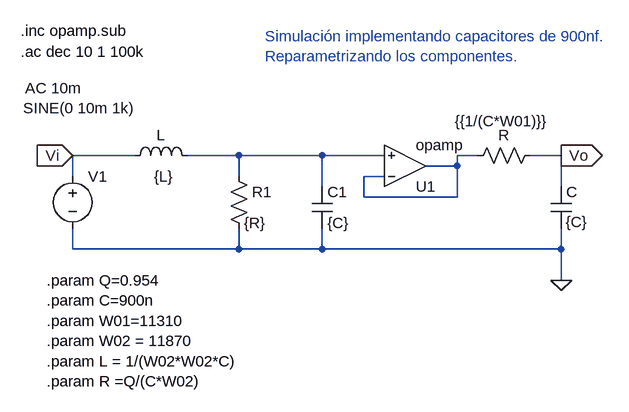
[diagram p0: schematic pasabjos2.asc]
pasabjos2.asc, the LTspice schematic file:
Version 4
SHEET 1 880 680
WIRE -112 96 -208 96
WIRE 48 96 -32 96
WIRE 176 96 48 96
WIRE 272 96 176 96
WIRE 416 96 384 96
WIRE 544 96 496 96
WIRE 384 112 384 96
WIRE 384 112 336 112
WIRE -208 128 -208 96
WIRE 48 128 48 96
WIRE 272 128 240 128
WIRE 176 144 176 96
WIRE 544 144 544 96
WIRE 240 160 240 128
WIRE 384 160 384 112
WIRE 384 160 240 160
WIRE -208 240 -208 208
WIRE 48 240 48 208
WIRE 48 240 -208 240
WIRE 176 240 176 208
WIRE 176 240 48 240
WIRE 544 240 544 208
WIRE 544 240 176 240
WIRE 544 288 544 240
FLAG 544 96 Vo
IOPIN 544 96 Out
FLAG -208 96 Vi
IOPIN -208 96 In
FLAG 544 288 0
SYMBOL res 512 80 R90
WINDOW 0 0 56 VBottom 2
WINDOW 3 -53 59 VTop 2
SYMATTR InstName R
SYMATTR Value {{1/(C*W01)}}
SYMBOL cap 528 144 R0
WINDOW 3 23 54 Left 2
SYMATTR InstName C
SYMATTR Value {C}
SYMBOL ind -128 112 R270
WINDOW 0 32 56 VTop 2
WINDOW 3 -1 60 VBottom 2
SYMATTR InstName L
SYMATTR Value {L}
SYMBOL res 32 112 R0
WINDOW 3 24 88 Left 2
SYMATTR Value {R}
SYMATTR InstName R1
SYMBOL cap 160 144 R0
SYMATTR InstName C1
SYMATTR Value {C}
SYMBOL OpAmps\\opamp 304 176 M180
SYMATTR InstName U1
SYMBOL voltage -208 112 R0
WINDOW 3 -76 -89 Left 2
WINDOW 123 -73 -120 Left 2
WINDOW 39 0 0 Left 0
SYMATTR Value SINE(0 10m 1k)
SYMATTR Value2 AC 10m
SYMATTR InstName V1
TEXT -248 288 Left 2 !.param Q=0.954\n.param C=900n\n.param W01=11310\n.param W02 = 11870\n.param L = 1/(W02*W02*C)\n.param R =Q/(C*W02)
TEXT -288 -64 Left 2 !.ac dec 10 1 100k
TEXT -288 -96 Left 2 !.inc opamp.sub
TEXT 88 -88 Left 2 ;Simulación implementando capacitores de 900nf.\nReparametrizando los componentes.

The netlist it stands for:
* pasabjos2.asc
R Vo N002 {{1/(C*W01)}}
C Vo 0 {C}
L Vi N001 {L}
R1 N001 0 {R}
C1 N001 0 {C}
XU1 N002 N001 N002 opamp Aol=100K GBW=10Meg  ; pins invin noninvin out
V1 Vi 0 SINE(0 10m 1k) AC 10m
.param Q=0.954
.param C=900n
.param W01=11310
.param W02 = 11870
.param L = 1/(W02*W02*C)
.param R =Q/(C*W02)
.ac dec 10 1 100k
.inc opamp.sub
* Simulación implementando capacitores de 900nf.
* Reparametrizando los componentes.
.backanno
.end